# EAGLE schematic TempModule (EAGLE 9.5.1)
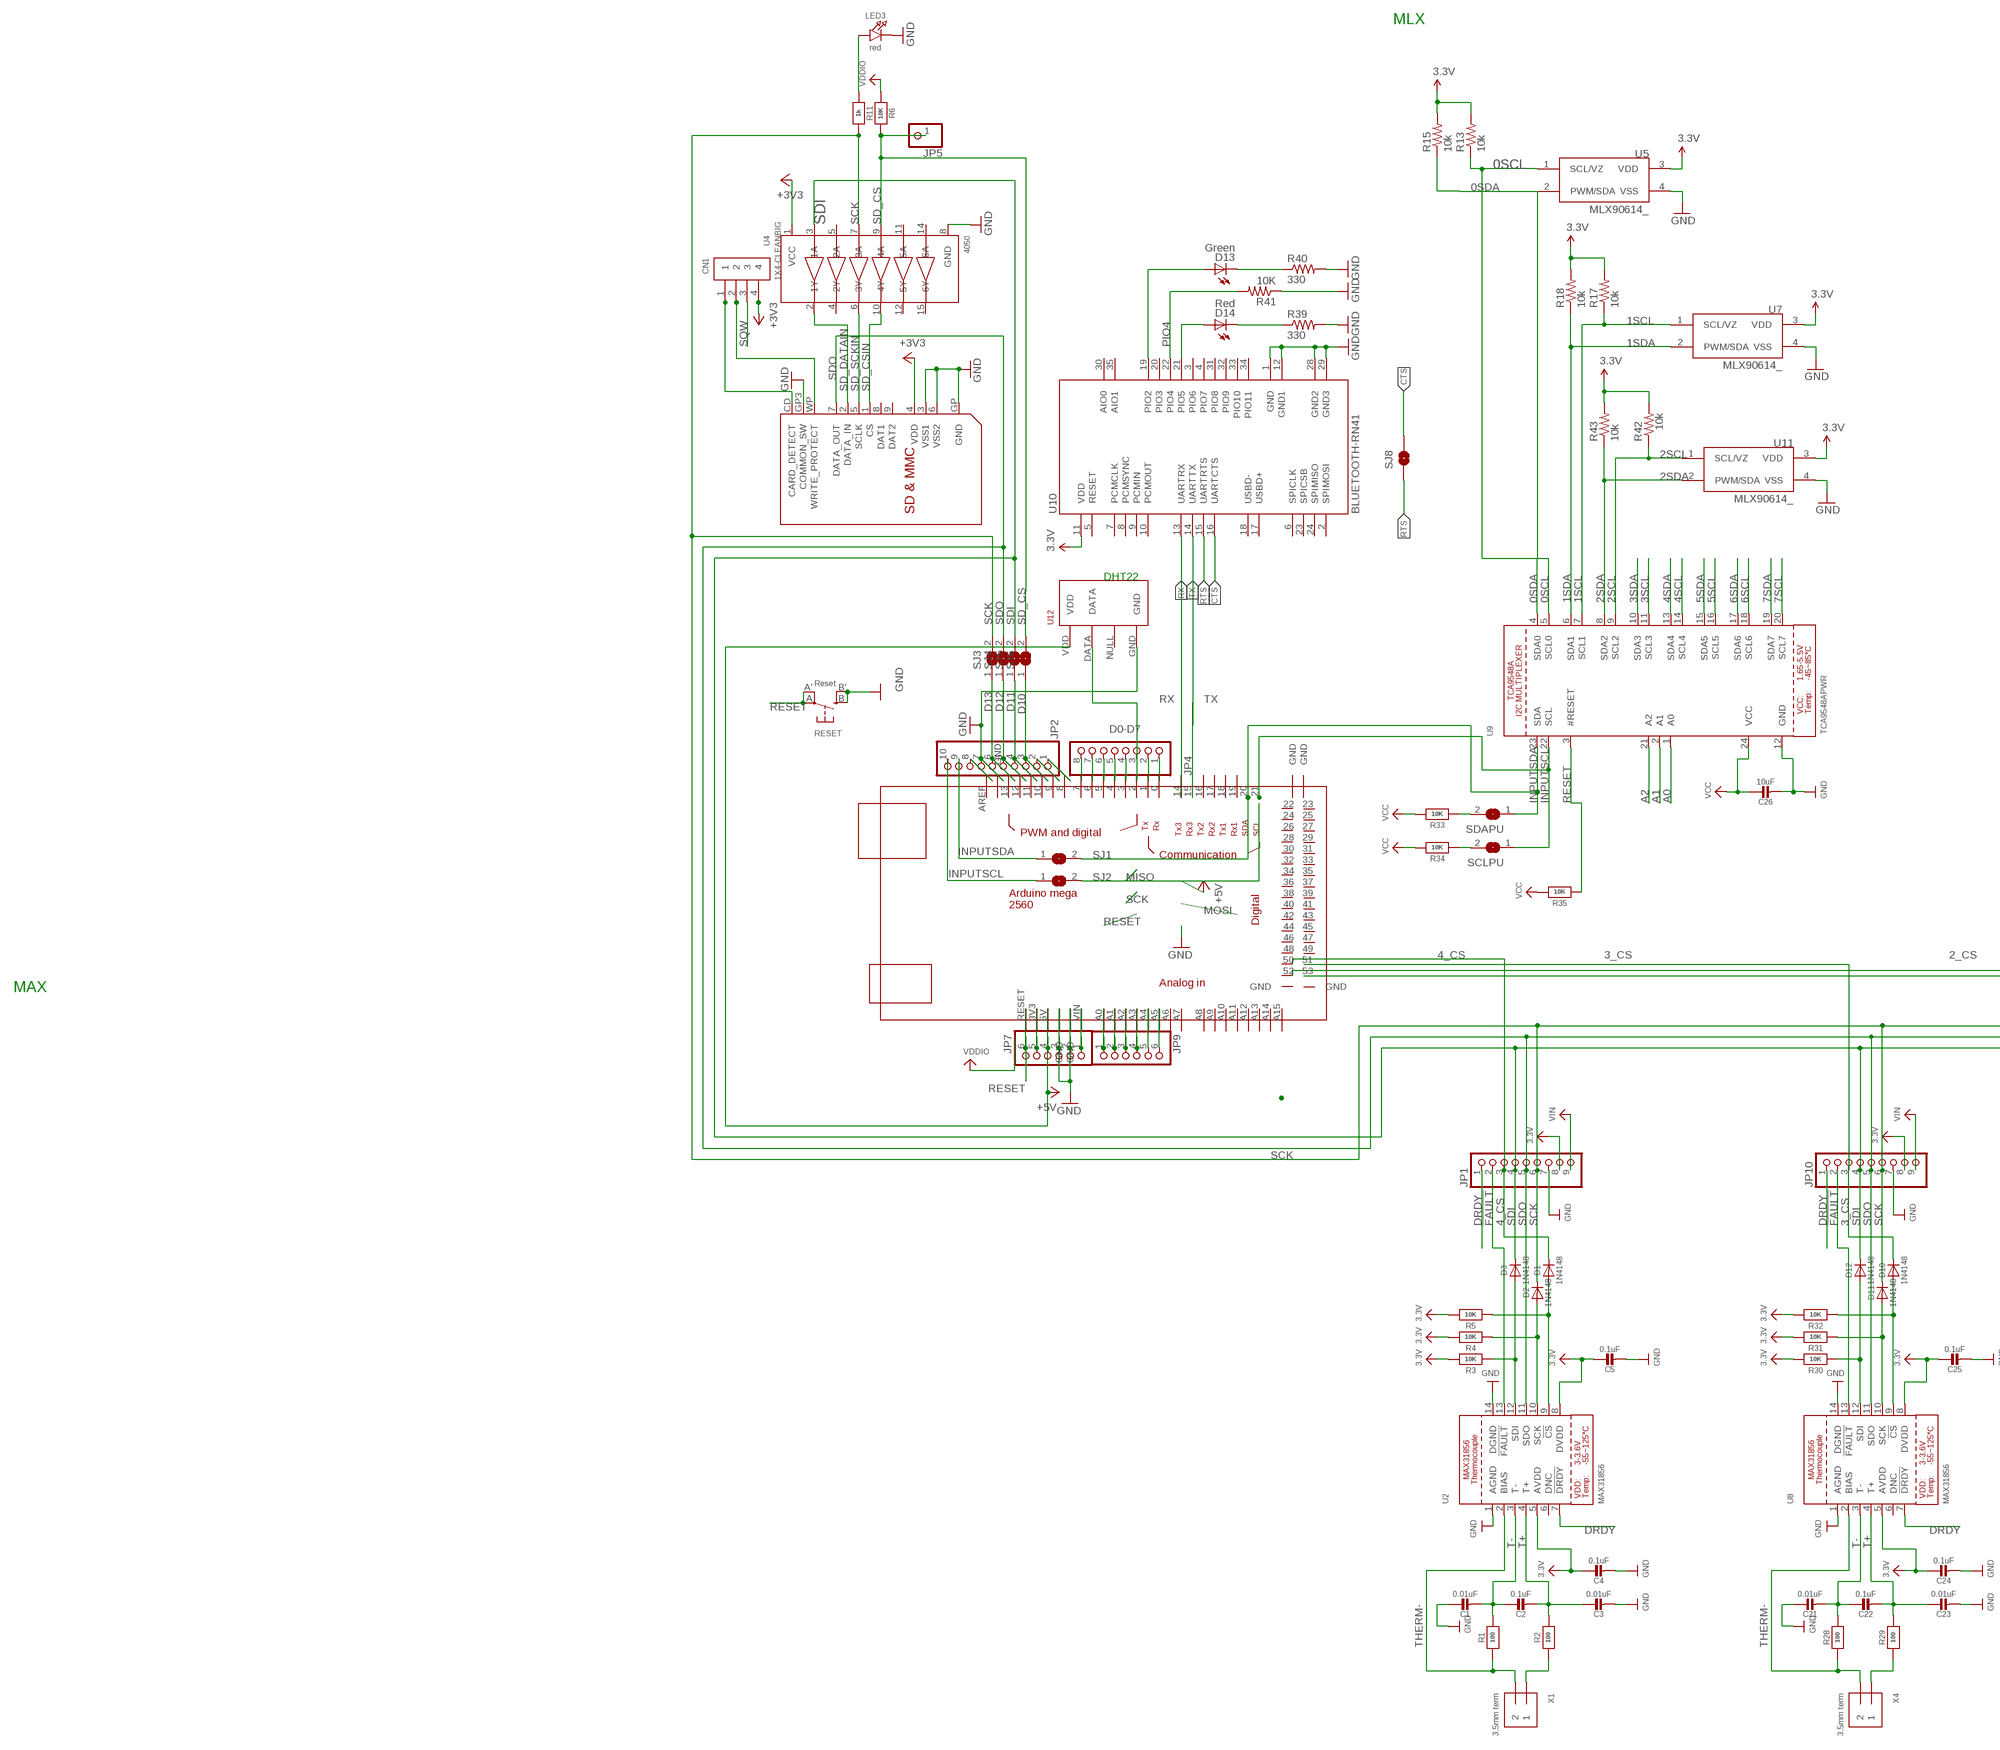
[diagram p0: schematic, sheet 1, part 1 of 2]
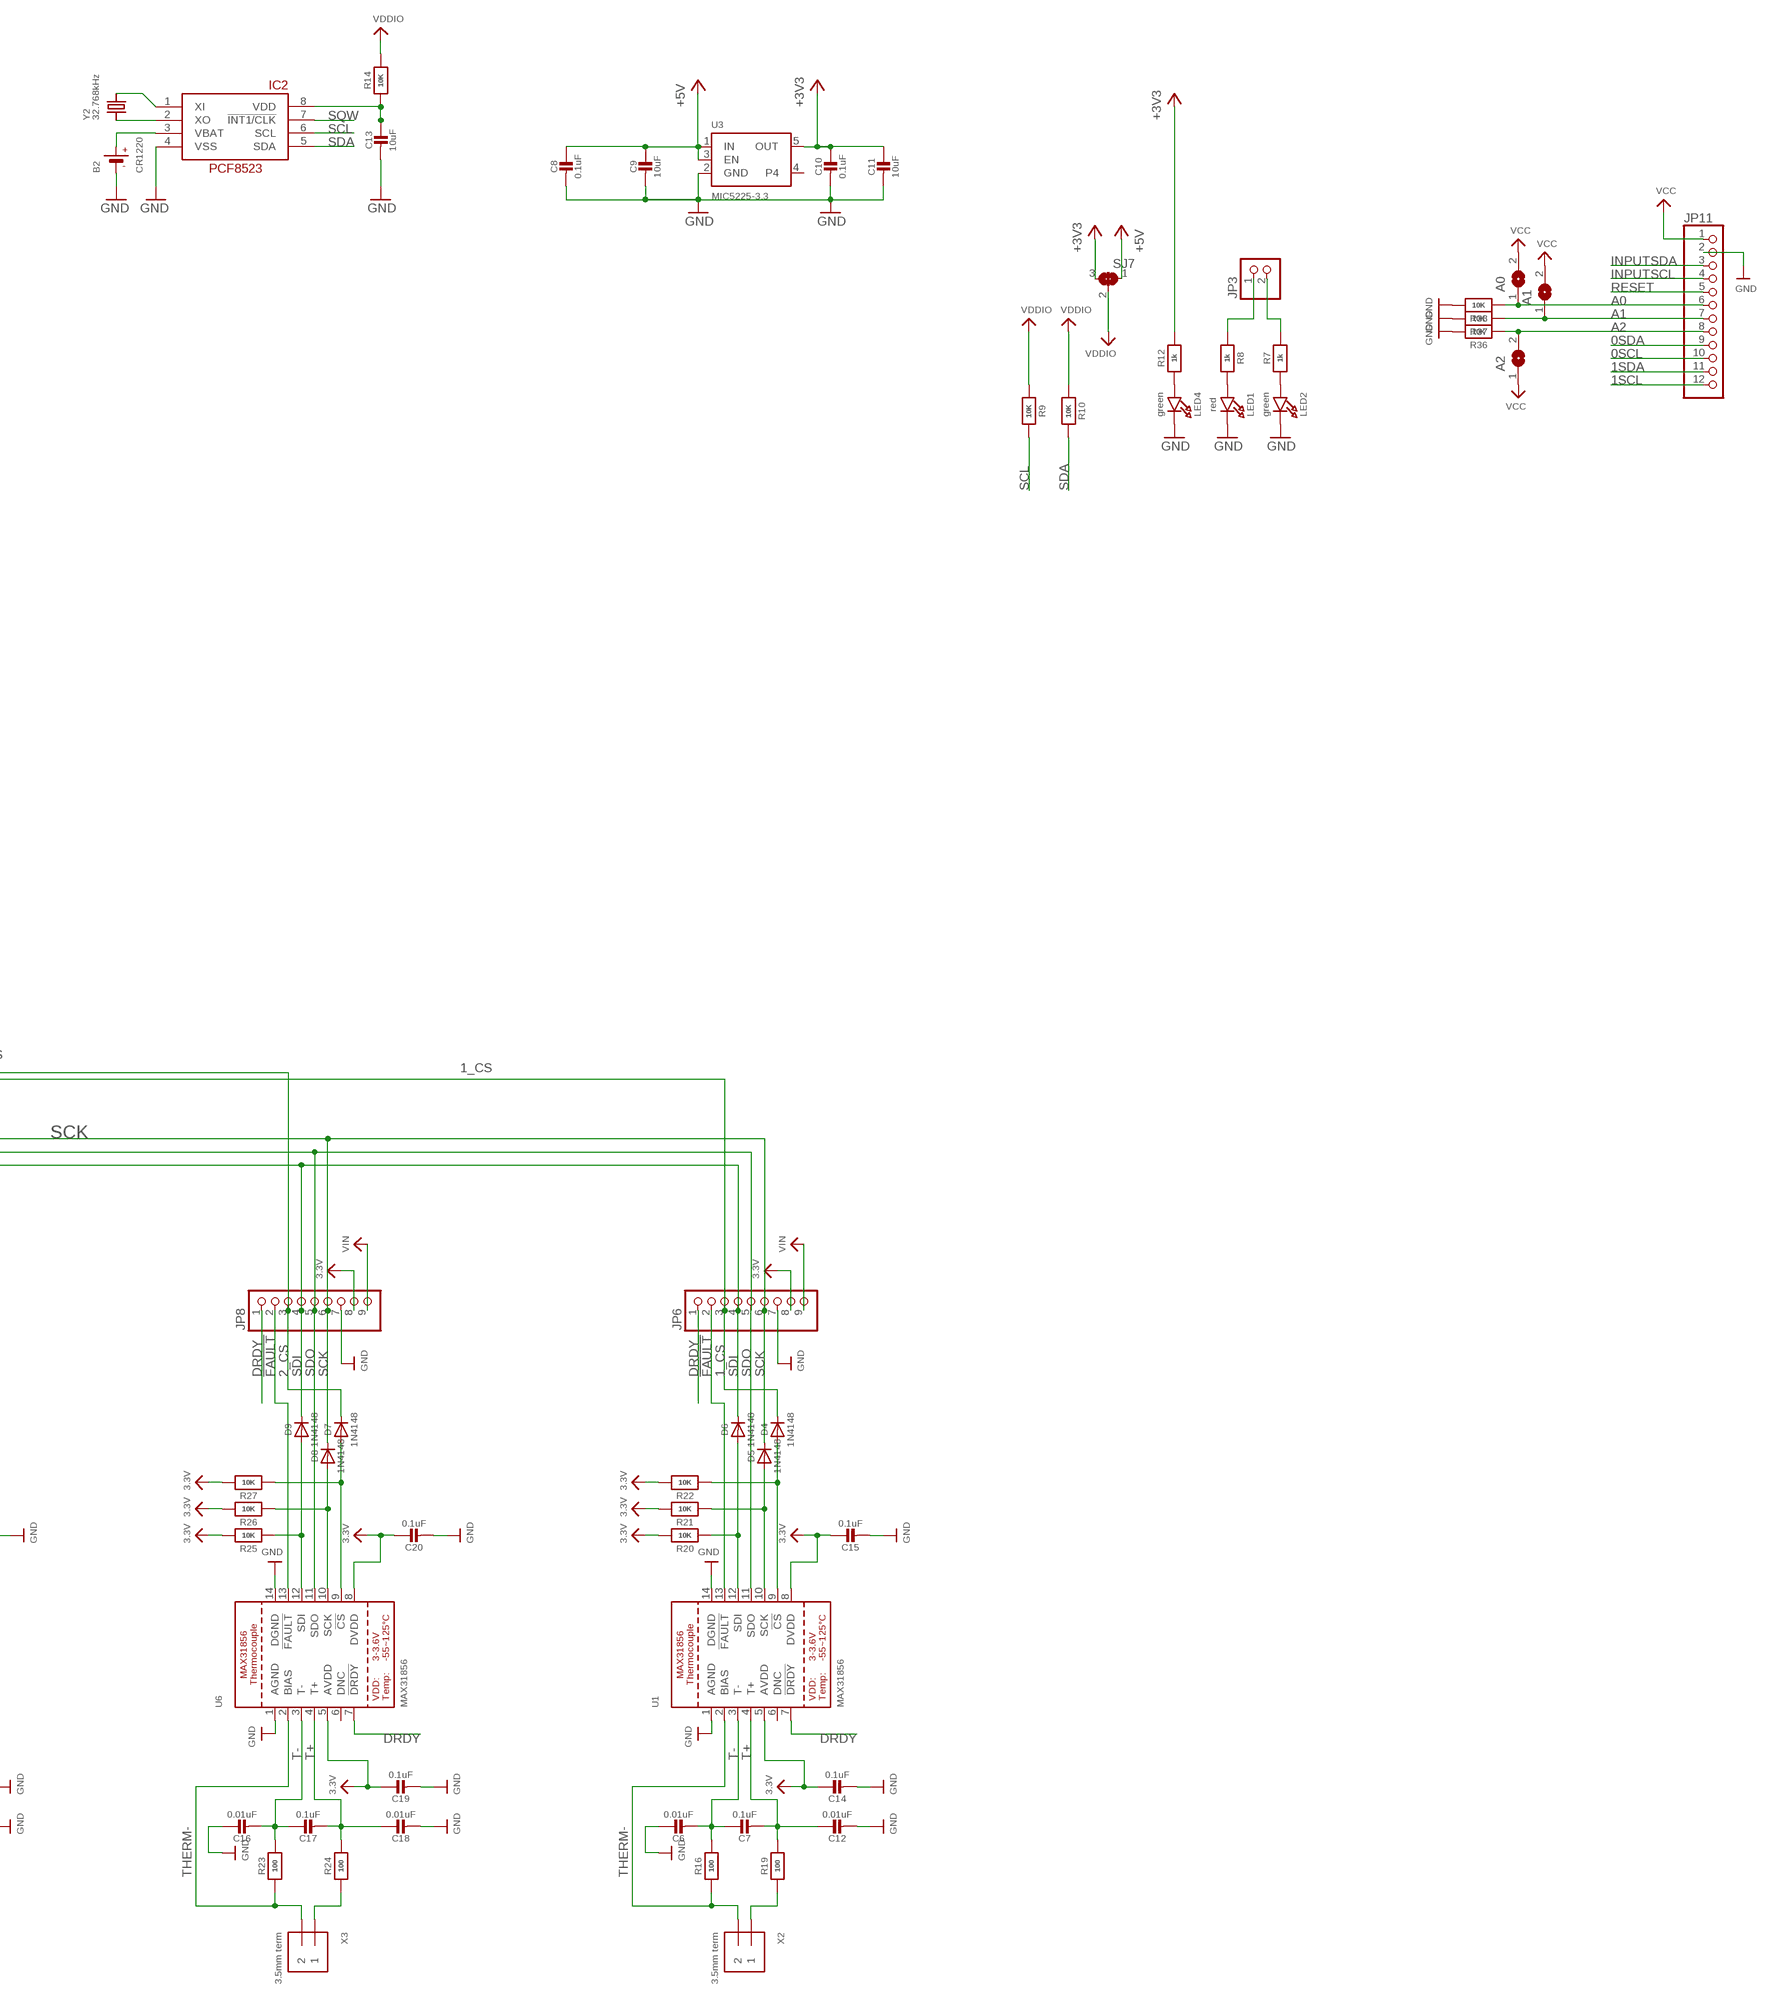
[diagram p1: schematic, sheet 1, part 2 of 2]

## Parts
A0  SOLDERJUMPER  [SOLDERJUMPER_ARROW_NOPASTE]
A1  SOLDERJUMPER  [SOLDERJUMPER_ARROW_NOPASTE]
A2  SOLDERJUMPER  [SOLDERJUMPER_ARROW_NOPASTE]
B2  CR1220  BATTERYCR1220_SMT  [CR1220]
C1  0.01uF  CAP_CERAMIC0805_10MGAP  [0805_10MGAP]
C2  0.1uF  CAP_CERAMIC0805-NOOUTLINE  [0805-NO]
C3  0.01uF  CAP_CERAMIC0805-NOOUTLINE  [0805-NO]
C4  0.1uF  CAP_CERAMIC0805-NOOUTLINE  [0805-NO]
C5  0.1uF  CAP_CERAMIC0805-NOOUTLINE  [0805-NO]
C6  0.01uF  CAP_CERAMIC0805_10MGAP  [0805_10MGAP]
C7  0.1uF  CAP_CERAMIC0805-NOOUTLINE  [0805-NO]
C8  0.1uF  CAP_CERAMIC0805-NOOUTLINE  [0805-NO]
C9  10uF  CAP_CERAMIC0805-NOOUTLINE  [0805-NO]
C10  0.1uF  CAP_CERAMIC0805-NOOUTLINE  [0805-NO]
C11  10uF  CAP_CERAMIC0805-NOOUTLINE  [0805-NO]
C12  0.01uF  CAP_CERAMIC0805-NOOUTLINE  [0805-NO]
C13  10uF  CAP_CERAMIC0805-NOOUTLINE  [0805-NO]
C14  0.1uF  CAP_CERAMIC0805-NOOUTLINE  [0805-NO]
C15  0.1uF  CAP_CERAMIC0805-NOOUTLINE  [0805-NO]
C16  0.01uF  CAP_CERAMIC0805_10MGAP  [0805_10MGAP]
C17  0.1uF  CAP_CERAMIC0805-NOOUTLINE  [0805-NO]
C18  0.01uF  CAP_CERAMIC0805-NOOUTLINE  [0805-NO]
C19  0.1uF  CAP_CERAMIC0805-NOOUTLINE  [0805-NO]
C20  0.1uF  CAP_CERAMIC0805-NOOUTLINE  [0805-NO]
C21  0.01uF  CAP_CERAMIC0805_10MGAP  [0805_10MGAP]
C22  0.1uF  CAP_CERAMIC0805-NOOUTLINE  [0805-NO]
C23  0.01uF  CAP_CERAMIC0805-NOOUTLINE  [0805-NO]
C24  0.1uF  CAP_CERAMIC0805-NOOUTLINE  [0805-NO]
C25  0.1uF  CAP_CERAMIC0805-NOOUTLINE  [0805-NO]
C26  10uF  CAP_CERAMIC0805-NOOUTLINE  [0805-NO]
CN1  1X4-CLEANBIG  [1X04-CLEANBIG]
D1  1N4148  DIODESOD-323  [SOD-323]
D2  1N4148  DIODESOD-323  [SOD-323]
D3  1N4148  DIODESOD-323  [SOD-323]
D4  1N4148  DIODESOD-323  [SOD-323]
D5  1N4148  DIODESOD-323  [SOD-323]
D6  1N4148  DIODESOD-323  [SOD-323]
D7  1N4148  DIODESOD-323  [SOD-323]
D8  1N4148  DIODESOD-323  [SOD-323]
D9  1N4148  DIODESOD-323  [SOD-323]
D10  1N4148  DIODESOD-323  [SOD-323]
D11  1N4148  DIODESOD-323  [SOD-323]
D12  1N4148  DIODESOD-323  [SOD-323]
D13  Green  LED0603  [LED-0603]
D14  Red  LED0603  [LED-0603]
IC2  PCF8523T  RTC_PCF8523T  [SOIC8_150MIL]
JP1  HEADER-1X970MIL  [1X09_ROUND_70]
JP2  HEADER-1X1070MIL  [1X10_ROUND70]
JP3  HEADER-1X2ROUND  [1X02_ROUND]
JP4  D0-D7  PINHD-1X8BIG  [1X08-BIG]
JP5  HEADER-1X1ROUND  [1X01_ROUND]
JP6  HEADER-1X970MIL  [1X09_ROUND_70]
JP7  PINHD-1X6B  [1X06-BIG]
JP8  HEADER-1X970MIL  [1X09_ROUND_70]
JP9  PINHD-1X6B  [1X06-BIG]
JP10  HEADER-1X970MIL  [1X09_ROUND_70]
JP11  HEADER-1X12  [1X12_ROUND]
LED1  red  LED0805_NOOUTLINE  [CHIPLED_0805_NOOUTLINE]
LED2  green  LED0805_NOOUTLINE  [CHIPLED_0805_NOOUTLINE]
LED3  red  LED0805_NOOUTLINE  [CHIPLED_0805_NOOUTLINE]
LED4  green  LED0805_NOOUTLINE  [CHIPLED_0805_NOOUTLINE]
R1  100  RESISTOR0805_NOOUTLINE  [0805-NO]
R2  100  RESISTOR0805_NOOUTLINE  [0805-NO]
R3  10K  RESISTOR0805_NOOUTLINE  [0805-NO]
R4  10K  RESISTOR0805_NOOUTLINE  [0805-NO]
R5  10K  RESISTOR0805_NOOUTLINE  [0805-NO]
R6  10K  RESISTOR0805_NOOUTLINE  [0805-NO]
R7  1k  RESISTOR0805_NOOUTLINE  [0805-NO]
R8  1k  RESISTOR0805_NOOUTLINE  [0805-NO]
R9  10K  RESISTOR0805_NOOUTLINE  [0805-NO]
R10  10K  RESISTOR0805_NOOUTLINE  [0805-NO]
R11  1k  RESISTOR0805_NOOUTLINE  [0805-NO]
R12  1k  RESISTOR0805_NOOUTLINE  [0805-NO]
R13  10k  RESISTOR0402-RES  [0402-RES]
R14  10K  RESISTOR0805_NOOUTLINE  [0805-NO]
R15  10k  RESISTOR0402-RES  [0402-RES]
R16  100  RESISTOR0805_NOOUTLINE  [0805-NO]
R17  10k  RESISTOR0402-RES  [0402-RES]
R18  10k  RESISTOR0402-RES  [0402-RES]
R19  100  RESISTOR0805_NOOUTLINE  [0805-NO]
R20  10K  RESISTOR0805_NOOUTLINE  [0805-NO]
R21  10K  RESISTOR0805_NOOUTLINE  [0805-NO]
R22  10K  RESISTOR0805_NOOUTLINE  [0805-NO]
R23  100  RESISTOR0805_NOOUTLINE  [0805-NO]
R24  100  RESISTOR0805_NOOUTLINE  [0805-NO]
R25  10K  RESISTOR0805_NOOUTLINE  [0805-NO]
R26  10K  RESISTOR0805_NOOUTLINE  [0805-NO]
R27  10K  RESISTOR0805_NOOUTLINE  [0805-NO]
R28  100  RESISTOR0805_NOOUTLINE  [0805-NO]
R29  100  RESISTOR0805_NOOUTLINE  [0805-NO]
R30  10K  RESISTOR0805_NOOUTLINE  [0805-NO]
R31  10K  RESISTOR0805_NOOUTLINE  [0805-NO]
R32  10K  RESISTOR0805_NOOUTLINE  [0805-NO]
R33  10K  RESISTOR0805_NOOUTLINE  [0805-NO]
R34  10K  RESISTOR0805_NOOUTLINE  [0805-NO]
R35  10K  RESISTOR_0805MP  [_0805MP]
R36  10K  RESISTOR0805_NOOUTLINE  [0805-NO]
R37  10K  RESISTOR0805_NOOUTLINE  [0805-NO]
R38  10K  RESISTOR0805_NOOUTLINE  [0805-NO]
R39  330  RESISTOR0603-RES  [0603-RES]
R40  330  RESISTOR0603-RES  [0603-RES]
R41  10K  RESISTOR0603-RES  [0603-RES]
R42  10k  RESISTOR0402-RES  [0402-RES]
R43  10k  RESISTOR0402-RES  [0402-RES]
RESET  Reset  SWITCH_TACT_SMT_EVQQ2_SMALL  [EVQ-Q2_SMALLER]
SCLPU  SOLDERJUMPERCLOSED  [SOLDERJUMPER_CLOSEDWIRE]
SDAPU  SOLDERJUMPERCLOSED  [SOLDERJUMPER_CLOSEDWIRE]
SJ1  SOLDERJUMPER  [SOLDERJUMPER_ARROW_NOPASTE]
SJ2  SOLDERJUMPER  [SOLDERJUMPER_ARROW_NOPASTE]
SJ3  SOLDERJUMPER  [SOLDERJUMPER_ARROW_NOPASTE]
SJ4  SOLDERJUMPER  [SOLDERJUMPER_ARROW_NOPASTE]
SJ5  SOLDERJUMPER  [SOLDERJUMPER_ARROW_NOPASTE]
SJ6  SOLDERJUMPERCLOSED  [SOLDERJUMPER_CLOSEDWIRE]
SJ7  SOLDERJUMPER_2WAY  [SOLDERJUMPER_2WAY_OPEN_NOPASTE]
SJ8  SOLDERJUMPERNO  [SJ_2S-NO]
U1  MAX31856  [TSSOP14]
U2  MAX31856  [TSSOP14]
U3  MIC5225-3.3  VREG_SOT23-5  [SOT23-5]
U4  4050  74HC4050D  [SOIC16]
U5  MLX90614_  [TO-39]
U6  MAX31856  [TSSOP14]
U7  MLX90614_  [TO-39]
U8  MAX31856  [TSSOP14]
U9  TCA9548APWR  TCA9548A  [TSSOP24]
U10  BLUETOOTH-RN41  BLUETOOTH-RN41"  [RN41]
U11  MLX90614_  [TO-39]
U12  RHT03_DHT-22_AM2302  [RHT03_DHT-22]
U$1  MEGA_DEVICE  [MEGAOUTLINE]
U$14  SDMMC06132  [06132]
X1  3.5mm term  TERMBLOCK_1X2  [TERMBLOCK_1X2-3.5MM]
X2  3.5mm term  TERMBLOCK_1X2  [TERMBLOCK_1X2-3.5MM]
X3  3.5mm term  TERMBLOCK_1X2  [TERMBLOCK_1X2-3.5MM]
X4  3.5mm term  TERMBLOCK_1X2  [TERMBLOCK_1X2-3.5MM]
Y2  32.768kHz  CRYSTAL8.0X3.8  [CRYSTAL_8X3.8]

## Nets
0SCL: JP11.10 R13.1 U5.1(SCL/VZ) U9.5(SCL0)
0SDA: JP11.9 R15.1 U5.2(PWM/SDA) U9.4(SDA0)
1_CS: D4.C JP6.3 U$1.53
1SCL: JP11.12 R17.1 U7.1(SCL/VZ) U9.7(SCL1)
1SDA: JP11.11 R18.1 U7.2(PWM/SDA) U9.6(SDA1)
2_CS: D7.C JP8.3 U$1.52
2SCL: R42.1 U9.9(SCL2) U11.1(SCL/VZ)
2SDA: R43.1 U9.8(SDA2) U11.2(PWM/SDA)
3.3V: C4.1 C5.1 C14.1 C15.1 C19.1 C20.1 C24.1 C25.1 JP1.8 JP6.8 JP8.8 JP10.8 R3.2 R4.2 R5.2 R13.2 R15.2 R17.2 R18.2 R20.2 R21.2 R22.2 R25.2 R26.2 R27.2 R30.2 R31.2 R32.2 R42.2 R43.2 U1.5(AVDD) U1.8(DVDD) U2.5(AVDD) U2.8(DVDD) U5.3(VDD) U6.5(AVDD) U6.8(DVDD) U7.3(VDD) U8.5(AVDD) U8.8(DVDD) U10.11(VDD) U11.3(VDD)
3.3V1: JP7.5 U$1.3V3
3_CS: D10.C JP10.3 U$1.51
3SCL: U9.11(SCL3)
3SDA: U9.10(SDA3)
4_CS: D1.C JP1.3 U$1.50
4SCL: U9.14(SCL4)
4SDA: U9.13(SDA4)
5SCL: U9.16(SCL5)
5SDA: U9.15(SDA5)
6SCL: U9.18(SCL6)
6SDA: U9.17(SDA6)
7SCL: U9.20(SCL7)
7SDA: U9.19(SDA7)
!CS_3V: D1.A R5.1 U2.9(!CS)
!CS_3V1: D4.A R22.1 U1.9(!CS)
!CS_3V2: D7.A R27.1 U6.9(!CS)
!CS_3V3: D10.A R32.1 U8.9(!CS)
!FAULT: JP1.2 JP6.2 JP8.2 JP10.2 U1.13(!FAULT) U2.13(!FAULT) U6.13(!FAULT) U8.13(!FAULT)
+3V3: C10.1 C11.1 CN1.4 R12.2 SJ7.3 U3.5(OUT) U4.1(VCC) U$14.4(VDD)
+5V: C8.1 C9.1 JP7.4 SJ7.1 U3.1(IN) U3.3(EN) U12.VDD U$1.5V
A0: A0.1 JP11.6 R38.1 U9.1(A0)
A1: A1.1 JP11.7 R37.1 U9.2(A1)
A2: A2.2 JP11.8 R36.1 U9.21(A2)
A5: JP9.6 SJ2.2 U$1.A5
CTS: SJ8.2 U10.16(UARTCTS)
D2: D14.C R39.1
D3: D13.C R40.1
D10: JP2.3 SJ6.1
D11: JP2.4 SJ5.1
D12: JP2.5 SJ4.1
D13: JP2.6 SJ3.1
DRDY: JP1.1 JP6.1 JP8.1 JP10.1 U1.7(!DRDY) U2.7(!DRDY) U6.7(!DRDY) U8.7(!DRDY)
GND: B2.- C1.1 C3.2 C4.2 C5.2 C6.1 C8.2 C9.2 C10.2 C11.2 C12.2 C13.2 C14.2 C15.2 C16.1 C18.2 C19.2 C20.2 C21.1 C23.2 C24.2 C25.2 C26.2 IC2.4(VSS) JP1.7 JP2.7 JP6.7 JP7.2 JP7.3 JP8.7 JP10.7 JP11.2 LED1.C LED2.C LED3.C LED4.C R36.2 R37.2 R38.2 R39.2 R40.2 R41.1 RESET.B'(S1) RESET.B(S) U1.1(AGND) U1.14(DGND) U2.1(AGND) U2.14(DGND) U3.2(GND) U4.8(GND) U5.4(VSS) U6.1(AGND) U6.14(DGND) U7.4(VSS) U8.1(AGND) U8.14(DGND) U9.12(GND) U10.1(GND) U10.12(GND1) U10.28(GND2) U10.29(GND3) U11.4(VSS) U12.GND U$1.GND@2(GND) U$1.GND@3(GND) U$14.3(VSS1) U$14.6(VSS2) U$14.GP3(COMMON_SW) U$14.GP(GND)
INPUTSCL: JP2.10 JP11.4 SCLPU.1 SJ2.1 U9.22(SCL) U$1.21
INPUTSDA: JP2.9 JP11.3 SDAPU.1 SJ1.1 SJ1.2 U9.23(SDA) U$1.20
N$1: LED1.A R8.2
N$2: R33.1 SDAPU.2
N$3: R34.1 SCLPU.2
N$4: LED2.A R7.1
N$5: LED3.A R11.1
N$6: IC2.2(XO) Y2.P$1
N$7: IC2.1(XI) Y2.P$4
N$8: C13.1 IC2.8(VDD) R14.1
N$9: D14.A U10.21(PIO5)
N$10: D13.A U10.19(PIO2)
N$12: JP9.5 U$1.A4
N$15: JP7.1 U$1.VIN
N$17: JP3.2 R7.2
N$20: JP3.1 R8.1
N$87: JP4.1
N$88: JP4.2
N$89: JP4.3 U12.DATA
N$90: JP4.4
N$98: JP4.5
N$99: JP4.6
N$100: JP4.7
N$101: JP4.8
N$108: JP2.8
N$110: JP2.2
N$111: JP2.1
N$150: LED4.A R12.1
N$154: JP9.1 U$1.A0
N$164: JP9.2 U$1.A1
N$181: JP9.3 U$1.A2
N$182: JP9.4 U$1.A3
PIO4: R41.2 U10.22(PIO4)
RESET: JP7.6 JP11.5 R35.1 RESET.A'(P1) RESET.A(P) U9.3(#RESET) U$1.RESET
RTS: SJ8.1 U10.15(UARTRTS)
RX: U10.13(UARTRX) U$1.14
SCK: D2.C D5.C D8.C D11.C JP1.6 JP6.6 JP8.6 JP10.6 R11.2 SJ3.2 U4.7(3A)
SCK_3V: D2.A R4.1 U2.10(SCK)
SCK_3V1: D5.A R21.1 U1.10(SCK)
SCK_3V2: D8.A R26.1 U6.10(SCK)
SCK_3V3: D11.A R31.1 U8.10(SCK)
SCL: IC2.6(SCL) R9.2
SD_CD: CN1.1 U$14.CD(CARD_DETECT)
SD_CS: JP5.1 R6.2 SJ6.2 U4.9(4A)
SD_CSIN: U4.10(4Y) U$14.1(CS)
SD_DATAIN: U4.2(1Y) U$14.2(DATA_IN)
SD_SCKIN: U4.6(3Y) U$14.5(SCLK)
SD_WP: CN1.2 U$14.WP(WRITE_PROTECT)
SDA: IC2.5(SDA) R10.2
SDI: D3.C D6.C D9.C D12.C JP1.4 JP6.4 JP8.4 JP10.4 SJ5.2 U4.3(1A)
SDO: JP1.5 JP6.5 JP8.5 JP10.5 SJ4.2 U1.11(SDO) U2.11(SDO) U6.11(SDO) U8.11(SDO) U$14.7(DATA_OUT)
SDO_3V: D3.A R3.1 U2.12(SDI)
SDO_3V1: D6.A R20.1 U1.12(SDI)
SDO_3V2: D9.A R25.1 U6.12(SDI)
SDO_3V3: D12.A R30.1 U8.12(SDI)
SQW: CN1.3 IC2.7(!INT1/CLK)
T+: C2.2 C3.1 C7.2 C12.1 C17.2 C18.1 C22.2 C23.1 R2.2 R19.2 R24.2 R29.2 U1.4(T+) U2.4(T+) U6.4(T+) U8.4(T+)
T-: C1.2 C2.1 C6.2 C7.1 C16.2 C17.1 C21.2 C22.1 R1.2 R16.2 R23.2 R28.2 U1.3(T-) U2.3(T-) U6.3(T-) U8.3(T-)
THERM+: R2.1 X1.1
THERM+1: R19.1 X2.1
THERM+2: R24.1 X3.1
THERM+3: R29.1 X4.1
THERM-: R1.1 R16.1 R23.1 R28.1 U1.2(BIAS) U2.2(BIAS) U6.2(BIAS) U8.2(BIAS) X1.2 X2.2 X3.2 X4.2
TX: U10.14(UARTTX) U$1.15
VBAT1: B2.+$1(+) B2.+$2(+) IC2.3(VBAT)
VCC: A0.2 A1.2 A2.1 C26.1 JP11.1 R33.2 R34.2 R35.2 U9.24(VCC)
VDDIO: R6.1 R9.1 R10.1 R14.2 SJ7.2
VIN: JP1.9 JP6.9 JP8.9 JP10.9
Unconnected: U1.6(DNC) U2.6(DNC) U3.4 U4.4(2Y) U4.5(2A) U4.11(5A) U4.12(5Y) U4.14(6A) U4.15(6Y) U6.6(DNC) U8.6(DNC) U10.2(SPIMOSI) U10.3(PIO6) U10.4(PIO7) U10.5(RESET) U10.6(SPICLK) U10.7(PCMCLK) U10.8(PCMSYNC) U10.9(PCMIN) U10.10(PCMOUT) U10.17(USBD+) U10.18(USBD-) U10.20(PIO3) U10.23(SPICSB) U10.24(SPIMISO) U10.30(AIO0) U10.31(PIO8) U10.32(PIO9) U10.33(PIO10) U10.34(PIO11) U10.35(AIO1) U12.NULL U$1.0 U$1.1 U$1.2 U$1.3 U$1.4 U$1.5 U$1.6 U$1.7 U$1.8 U$1.9 U$1.10 U$1.11 U$1.12 U$1.13 U$1.16 U$1.17 U$1.18 U$1.19 U$1.22 U$1.23 U$1.24 U$1.25 U$1.26 U$1.27 U$1.28 U$1.29 U$1.30 U$1.31 U$1.32 U$1.33 U$1.34 U$1.35 U$1.36 U$1.37 U$1.38 U$1.39 U$1.40 U$1.41 U$1.42 U$1.43 U$1.44 U$1.45 U$1.46 U$1.47 U$1.48 U$1.49 U$1.A6 U$1.A7 U$1.A8 U$1.A9 U$1.A10 U$1.A11 U$1.A12 U$1.A13 U$1.A14 U$1.A15 U$1.AREF U$1.GND@1(GND) U$1.GND@4(GND) U$1.GND@5(GND) U$1.GND@6(GND) U$1.GND@7(GND) U$14.8(DAT1) U$14.9(DAT2)

## Notes on the sheet
- MLX
- DHT22
- MAX

## Library data of the parts
A0 A1 A2 SJ1-SJ5 = microbuilder:SOLDERJUMPER: SMD Solder JUMPER Solder the two pads together to create a connection, or remove the solder to break it. REFLOW - Use this footprint for solder paste and reflow ovens. WAVE - Use this footprint for hand-soldering (larger pads). CLOSED - Has a trace between the two pads to ensure it is closed by default. The trace needs to be cut to disable the jumper, and can be closed again by creating a solder bridge between the two pads.; BOM: EXCLUDE
B2 = microbuilder:BATTERY: CR1220 SMT - Digikey: 3001K-ND CD2032 BAT-HLD-001 - Digikey: BAT-HLD-001-ND
C1-C26 = microbuilder:CAP_CERAMIC: Ceramic Capacitors For new designs, use the packages preceded by an '_' character since they are more reliable: The following footprints should be used on most boards: _0402 - Standard footprint for regular board layouts _0603 - Standard footprint for regular board layouts _0805 - Standard footprint for regular board layouts _1206 - Standard footprint for regular board layouts For extremely tight-pitch boards where space is at a premium, the following 'micro-pitch' footprints can be used (smaller pads, no silkscreen outline, etc.): _0402MP - Micro-pitch footprint for very dense/compact boards _0603MP - Micro-pitch footprint for very dense/compact boards _0805MP - Micro-pitch footprint for very dense/compact boards _1206MP - Micro-pitch footprint for very dense/compact boards
CN1 = adafruit:1X4: 4-pin connector
D1-D12 = microbuilder:DIODE: Diode SMA Model Volts Amps Type Vf Ir Digikey # Notes SSA34-E3 40V 3A Schottky 480mV @ 3A 200uA @ 40V SSA34-E3/61TGITR-ND CDBA120-G 20V 1A Schottky 500mV @ 1A 500uA @ 20V 641-1014-6-ND REEL MBRA210 10V 2A Schottky 350mV @ 2A 700uA @ 10V MBRA210LT3 SOD-123 Model Volts Amps Type Vf Ir Order # Notes BAT54T1G 30V 200mA Schottky 800mV @ 200mA 2uA @ 25V BAT54T1GOSTR-ND B0530W 30V 500mA Schottky 430mV @ 500mA 130uA @ 30V B0530W-FDICT-ND REEL MBR120 20V 1A Schottky 340mV @ 1A MBR120VLSFT1GOSCT-ND SOD-323 Model Volts Amps Type Vf Ir Order # Notes PMEG2005EJ 20V 500mA Schottky 355mV @ 500mA 568-4110-1-ND ZLLS410 10V 570mA Schottky 380mV @ 570mA ZLLS410CT-ND 1N4148WS 75V 150mA Silicon/Simple 1V 1N4148WSFSCT-ND REEL SOD-523 Model Volts Amps Type Vf Ir Order # Notes BAT54XV2 30V 200mA Schottky 0.8V @ 100mA BAT54XV2CT-ND TB751S 30V 30mA Schottky RB751S-40TE61CT-ND SOT23-R/W (R = Solder Paste/Reflow Ovens, W = Hand-Soldering) Model Volts Amps Type Vf Ir Order # Notes BAT54FILM 40V 300mA Schottky 497-7162-1-ND POWERDI-5 Model Volts Amps Type Vf Ir Order # Notes PDS560 60V 5A Schottky 670mV @ 5A 150uA @ 60V PDS560DICT-ND
D13 D14 = SparkFun:LED: LEDs Standard schematic elements and footprints for 5mm, 3mm, 1206, and 0603 sized LEDs. 5mm - Spark Fun Electronics SKU : COM-00529 (and others)
IC2 = microbuilder:RTC_PCF8523
JP1 JP6 JP8 JP10 = microbuilder:HEADER-1X9: PIN HEADER
JP2 = microbuilder:HEADER-1X10: PIN HEADER
JP3 = microbuilder:HEADER-1X2: PIN HEADER
JP4 = adafruit:PINHD-1X8: PIN HEADER
JP5 = microbuilder:HEADER-1X1: PIN HEADER
JP7 JP9 = adafruit:PINHD-1X6: PIN HEADER
JP11 = microbuilder:HEADER-1X12
LED1-LED4 = microbuilder:LED: LED 0603 - 0603 Surface Mount Package 2mA: Green LED - Low Power (3.9mcd, 2ma, 1.7Vf) - Digikey: 475-2709-2-ND Orange LED - Low Power (9.8mcd, 2ma, 1.8Vf) - Digikey: 475-1194-2-ND Red LED - Low Power (5mcd, 2ma, 1.8Vf) - Digikey: 475-1195-2-ND Yellow LED - Low Power (7mcd, 2ma, 1.8Vf) - Digikey: 475-1196-2-ND 5mA: Blue LED - Low Power (17mcd, 5ma, 2.9Vf) - Digikey: LNJ937W8CRACT-ND 0805 - 0805 Surface Mount Package 2mA: Red LED (8.8mcd, 2mA, 1.8Vf, Clear) - Low Power [Digikey: 475-2510-1-ND] Green LED (5mcd, 2mA, 1.8Vf, Clear) - Low Power [Digikey: 475-2730-1-ND] Yellow LED (11.3mcd, 2mA, 1.8Vf, Clear) - Low Power [Digikey: 475-2555-1-ND] 20mA: Red LED (104mcd, 20mA, Diffused) - LS R976 [Digikey: 475-1278-6-ND] Red LED (12mcd, 20mA, 2.0Vf, Clear) - APT2012EC [Digikey: 754-1128-1-ND] Green LED (15mcd, 20mA, 2.2Vf, Clear) - APT2012GC [Digikey: 754-1131-1-ND] Orange LED (160mcd, 20mA, 2.1Vf, Clear) - APT2012SECK [Digikey: 754-1130-1-ND] 1206 - 1206 Surface Mount Package Green LED (26mcd, 20mA, Diffused) - LG N971 [Digikey: 475-1407-6-ND] Red LED (15mcd, 20mA, Diffused) - LH N974 [Digikey: 475-1416-6-ND] Cree - Cree High-Power Surface Mount LEDs XPEBWT-L1-0000-00D50 - White 111lm 350mA 2.9Vf 6200K 110° XTEAWT-00-0000-00000LEE3 - White 114lm 350mA 2.85Vf 5000K 115° Everlight - Everlight 45-21 Series Surface Mount LEDs 45-21/QK2C-B2832AC2CB2/2T - Warm White 2000mcd 20mA 3.25Vf 3050K 120° 45-21/LK2C-B38452C4CB2/2T - Nuetral White 2000mcd 20mA 3.25Vf 4150K 120° 45-21/LK2C-B50634C6CB2/2T - Cold White 2200mcd 20mA 3.25Vf 5650K 120° PLCC2 Reverse Mount LS T77K-J1L2-1-0-2-R18-Z - Red 11.25mcd 2mA 1.8Vf 630nm 120° LO T77K-L1M2-24-Z - Orange 19.6mcd 2mA 1.8Vf 606nm 120° LY T77K-K2M1-26-Z - Yellow 15.7mcd 2mA 1.8Vf 587nm 120°
R1-R12 R14 R16 R19-R38 = microbuilder:RESISTOR: Resistors For new designs, use the packages preceded by an '_' character since they are more reliable: The following footprints should be used on most boards: _0402 - Standard footprint for regular board layouts _0603 - Standard footprint for regular board layouts _0805 - Standard footprint for regular board layouts _1206 - Standard footprint for regular board layouts For extremely tight-pitch boards where space is at a premium, the following 'micro-pitch' footprints can be used (smaller pads, no silkscreen outline, etc.): _0402MP - Micro-pitch footprint for very dense/compact boards _0603MP - Micro-pitch footprint for very dense/compact boards _0805MP - Micro-pitch footprint for very dense/compact boards _1206MP - Micro-pitch footprint for very dense/compact boards
R13 R15 R17 R18 R39-R43 = SparkFun:RESISTOR: Resistor Basic schematic elements and footprints for 0603, 1206, and PTH resistors.
RESET = microbuilder:SWITCH_TACT_SMT: SMT Tact Switches 6x6mm - Digikey: P12940SCT-ND KMR2 (4.6x2.8mm) - Digikey: 401-1426-1-ND EVQ-PQHB55 - Light Touch, 160GF (4.5x4.5mm) - Digikey: P8090SCT-ND KMT0 - KMT021 NGJ LHS (etc.) IP68/Waterproof - Digikey: CKN10289CT-ND
SCLPU SDAPU SJ6 = microbuilder:SOLDERJUMPER: SMD Solder JUMPER Solder the two pads together to create a connection, or remove the solder to break it. REFLOW - Use this footprint for solder paste and reflow ovens. WAVE - Use this footprint for hand-soldering (larger pads). CLOSED - Has a trace between the two pads to ensure it is closed by default. The trace needs to be cut to disable the jumper, and can be closed again by creating a solder bridge between the two pads.
SJ7 = microbuilder:SOLDERJUMPER_2WAY: 2-Way Solder Jumper
SJ8 = SparkFun:SOLDERJUMPER: Solder Jumper Standard SMD solder jumper. Used to automate production. Two varients : Normally Open and Normally Closed are the same, but have different paste layers. NC will have a large amount of paste and should jumper during reflow.
U1 U2 U6 U8 = microbuilder:MAX31856: MAX31856 - Thermocouple Sensor ADC
U3 = microbuilder:VREG_SOT23-5: SOT23-5 Fixed Voltage Regulators Part Current Out V Out V In V Dropout θJA (°C/W) TJ (°C) Digikey Part No. ADP121 150mA 3.3V 3.4-5.5V 0.09V @ 150mA -- -- ADP121-AUJZ33R7CT-ND ADP121 150mA 3.0V 3.1-5.5V 0.09V @ 150mA -- -- ADP121-AUJZ30R7CT-ND ADP122 300mA 3.3V 3.4-5.5V 0.085V @ 300mA -- -- ADP122AUJZ-3.3-R7CT-ND ADP1712 300mA 3.3V 3.5-5.5V 0.17V @ 300mA -- -- ADP1712AUJZ-3.3-R7TR-ND AP7311 (Low Cost) 150mA 3.3V 3.5-6V 0.15V @ 150mA -- -- AP7311-33WG-7DICT-ND LD39015M18R 150mA 1.8V 1.9V-5.5V 0.08V @ 100mA -- -- 497-6977-1-ND LP2985A-33DBVR 150mA 3.3V 3.3-16V 0.28V @ 150mA 206 150 296-18479-1-ND MCP1824T-3302E/OT 300mA 3.3V 3.5V-6V 0.2V @ 300mA -- -- MCP1824T-3302E/OTCT-ND MIC5205-2.5YM5 TR 150mA 2.5V 2.7-16V 0.165V @ 150mA -- -- 576-1257-2-ND MIC5205-3.0YM5 TR 150mA 3.0V 3.2V-16V 0.165V @ 150mA -- -- 576-1258-2-ND MIC5205-3.3YM5 TR 150mA 3.3V 3.5V-16V 0.165V @ 150mA -- -- 576-1259-2-ND TPS780330220 150mA 3.3V+2.2V 3.6-5.5V 250mV Max -- -- 296-23332-1-ND TDA3663/N1,135 100mA 3.3V 3.5-45V 0.18V @ 50mA -- -- 568-5343-1-ND Max operating temp can be calculated using θJA, TJ (max junction temperature), and power in watts. Set the "Maximum Ambient Temperature" until it reaches TJ ("Max Junction Temperature"), which is the absolute limit for safe use of the regulator: Heat Sink Temperature Calculator <http://www.daycounter.com/Calculators/Heat-Sink-Temperature-Calculator.phtml> For example, With 12V source into a 3.3V LP2985 and a 30mA load, we are dissipating (12V-3.3V) * 0.03A = 0.261W. With a θJA of 206 °C/W, a TJ of 150°C, and 261mW we can safely use the chip without a heat sink up to 75°C (=147.1°C Junction Temperature).
U4 = microbuilder:74HC4050D: 6-channel level shifter 74HC4050D - 2V-6V Supply SOIC16 Digikey: 74HC4050D,653-ND Mouser: 771-74HC4050D-T TSSOP16 Digikey: 296-9215-1-ND Mouser:
U5 U7 U11 = SparkFun:MLX90614: Melexis IR Thermometer
U9 = microbuilder:TCA9548A: TCA9548A I2C Multiplexer
U10 = SparkFun-RF:BLUETOOTH-RN41: Bluetooth SMD module
U12 = RHT03_DHT-22_AM2302:RHT03_DHT-22_AM2302: RHT03 / DHT-22 / AM2302 Packages and symbol for the RHT03 / DHT-22 relative humidity and temperature sensor. Note: The AM2302 is a wired version of the DHT-22 which typically requires less clearance and is thus provided as a separate package.; PROD_ID: SEN-10167
U$1 = ArduinoMegaOutline:MEGA_DEVICE: mega card as device
U$14 = microbuilder:SDMMC: SD MMC Card holder 4UCON part #06132 - easy to solder
X1-X4 = microbuilder:TERMBLOCK_1X2: 3.5mm Terminal block http://www.ladyada.net/library/pcb/eaglelibrary.html
Y2 = microbuilder:CRYSTAL: Crystals HC49UP - Surface Mount Crystal 4.0MHz 18pF +/-30ppm Surface Mount Crystal [Digikey: 535-9857-1-ND] 12.0 MHz Surface Mount Crystal [Digikey: 535-9869-6-ND] 25.0 MHz Surface Mount Crystal [Digikey: 535-9078-1-ND] 2.5 x 2.0mm - MEMs SMT Crystal 16.0 MHz 10pF 20ppm 2.5 x 2.0mm Crystal [Digikey -40-85°C: 535-10923-1-ND] 3.2 x 2.5mm - MEMs SMT Crystal 12.0 MHz 8pF 15ppm 3.2 x 2.5mm Crystal [Digikey: -10-70°C: 644-1047-1-ND -40-125°C: 644-1128-1-ND] 40~85°C cheaper: 644-1173-6-ND 16.0 MHz 8pF 15ppm 3.2 x 2.5mm Crystal [Digikey: -10-70°C: 644-1049-1-ND -40-125°C: 644-1129-2-ND]-40~85°C cheaper: 644-1175-6-ND 16.0 MHz 10pF 10ppm 3.2 x 2.5mm Crystal [Digikey: 644-1100-1-ND] 27.12 MHz 18pF 30ppm 3.2 x 2.5mm Crystal [Digikey: 887-1424-1-ND] 27.12MHz 10pF 10ppm 3.2 x 2.5mm Crystal [Digikey: 887-1329-1-ND] 4.9 x 1.8mm - MEMs SMT Crystal 32.768 KHz 12.5pF 20ppm 4.9 x 1.8mm Crystal [Digikey: SE2415CT-ND] 8.0 x 3.8mm - Surface Mount Crystal 32.768kHz 12.5pF 20ppm -40°C-85°C [Digikey: 535-9166-2-ND] Cylinder 32.768KHz Cylinder Crystal (2x6mm body) [Ex. Digikey: 300-8341-2-ND]